# Altium schematic sheet Top.SchDoc
size A; Author: E. Sims; Organization: Let's Build Rockets Inc.; SheetNumber: 1; SheetTotal: 2
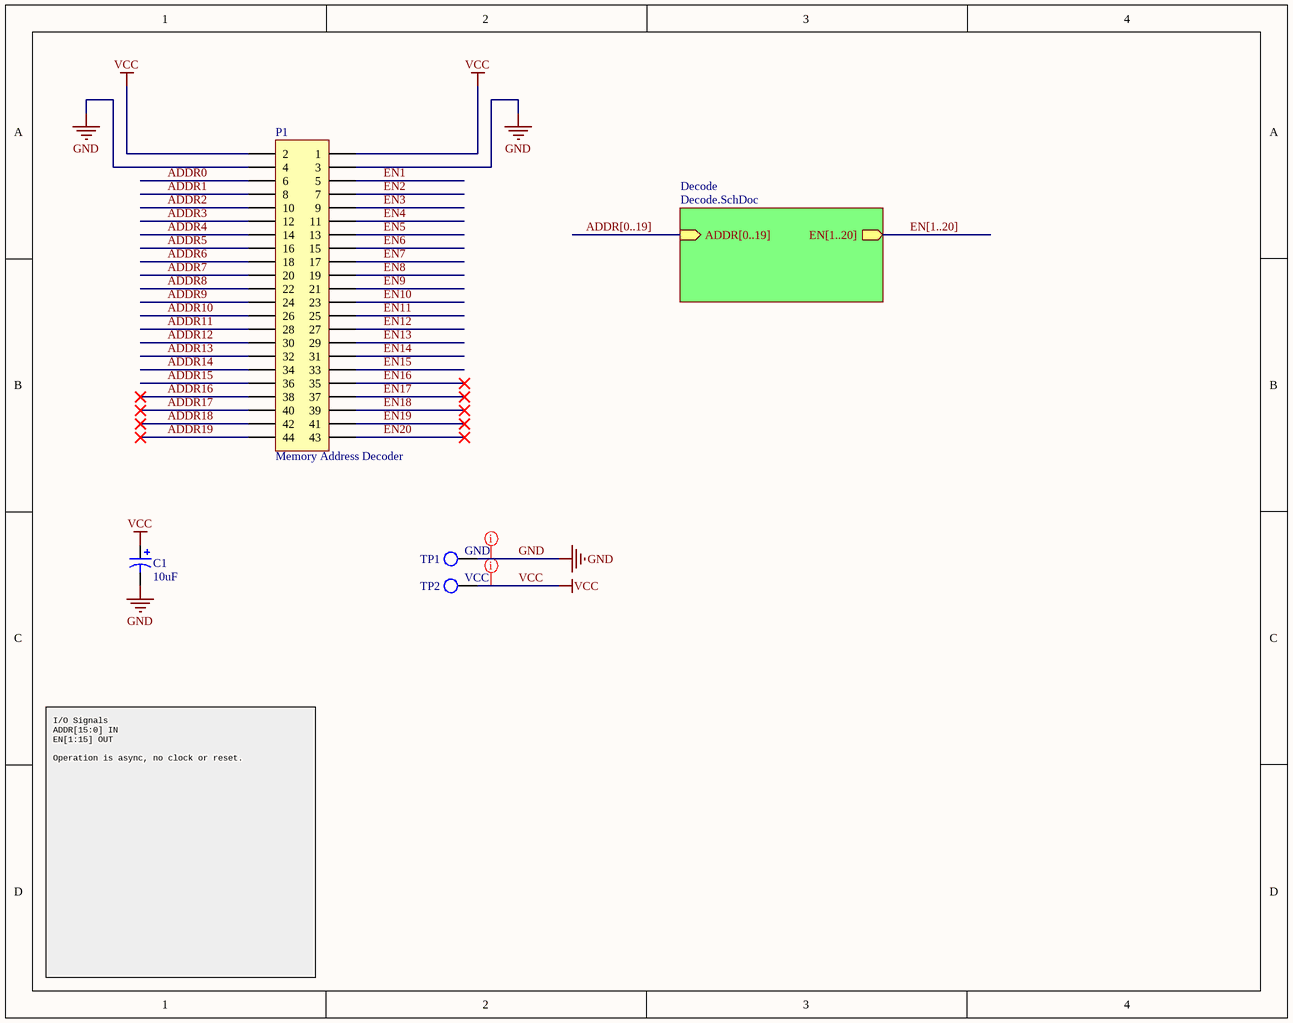
[diagram p0: Top.SchDoc]

## Parts
C1  value 10uF  [C5x7]  (hidden comment: Cap Pol5)
P1  Memory Address Decoder  [HDR2X22H]
TP1  GND  [KSTN-5011_V]  (no BOM)
TP2  VCC  [KSTN-5011_V]  (no BOM)

## Sub-sheets
Decode = Decode.SchDoc: EN[1..20] (out), ADDR[0..19] (in)

## Nets
GND: C1.2 P1.3 P1.4 TP1.1
VCC: C1.1 P1.1 P1.2 TP2.1
ADDR0: P1.6
ADDR1: P1.8
ADDR2: P1.10
ADDR3: P1.12
ADDR4: P1.14
ADDR5: P1.16
ADDR6: P1.18
ADDR7: P1.20
ADDR8: P1.22
ADDR9: P1.24
ADDR10: P1.26
ADDR11: P1.28
ADDR12: P1.30
ADDR13: P1.32
ADDR14: P1.34
ADDR15: P1.36
ADDR16: P1.38
ADDR17: P1.40
ADDR18: P1.42
ADDR19: P1.44
EN1: P1.5
EN2: P1.7
EN3: P1.9
EN4: P1.11
EN5: P1.13
EN6: P1.15
EN7: P1.17
EN8: P1.19
EN9: P1.21
EN10: P1.23
EN11: P1.25
EN12: P1.27
EN13: P1.29
EN14: P1.31
EN15: P1.33
EN16: P1.35
EN17: P1.37
EN18: P1.39
EN19: P1.41
EN20: P1.43

## Buses and harness runs
bus ADDR[0..19] = sheet Decode/ADDR[0..19]
bus EN[1..20] = sheet Decode/EN[1..20]

## Layout directives
rule Width Constraint [Pref Width = 20mil    Min Width = 20mil    Max Width = 50mil]; rule Routing Via Style [Pref Size = 35mil    Pref Hole Size = 20mil]; net class PWR: GND, VCC

## Notes on the sheet
- I/O Signals
  ADDR[15:0] IN
  EN[1:15] OUT
  Operation is async, no clock or reset.
- Let's Build Rocket's Inc. Modular Paylaod System Based on TMP-010 Rev
  For more information visit https://github.com/LetsBuildRockets/Modular-Payload-System
  This work is licensed under CC BY-NC 4.0. To view a copy of this license, visit https://creativecommons.org/licenses/by-nc/4.0
- Title
- Size:
- Date:
- Assembly Variant:
- B
- Number:
- Time:
- Revision:
- Sheet
- of
- Author:
- File:

## Library data of the parts
C1 = Cap Pol5: Polarized Capacitor; Published: 8-Jun-2000; LatestRevisionDate: 17-Jul-2002; LatestRevisionNote: Re-released for DXP Platform.; PackageReference: POLAR0.8; Publisher: Altium Limited; PackageDescription: Polarized Capacitor; 2 Leads
P1 = Header 22X2H: Header, 22-Pin, Dual row, Right Angle; System: Connector; LatestRevisionDate: 17-Jul-2002; LatestRevisionNote: Re-released for DXP Platform.; Publisher: Altium Limited
TP1 TP2 = TP